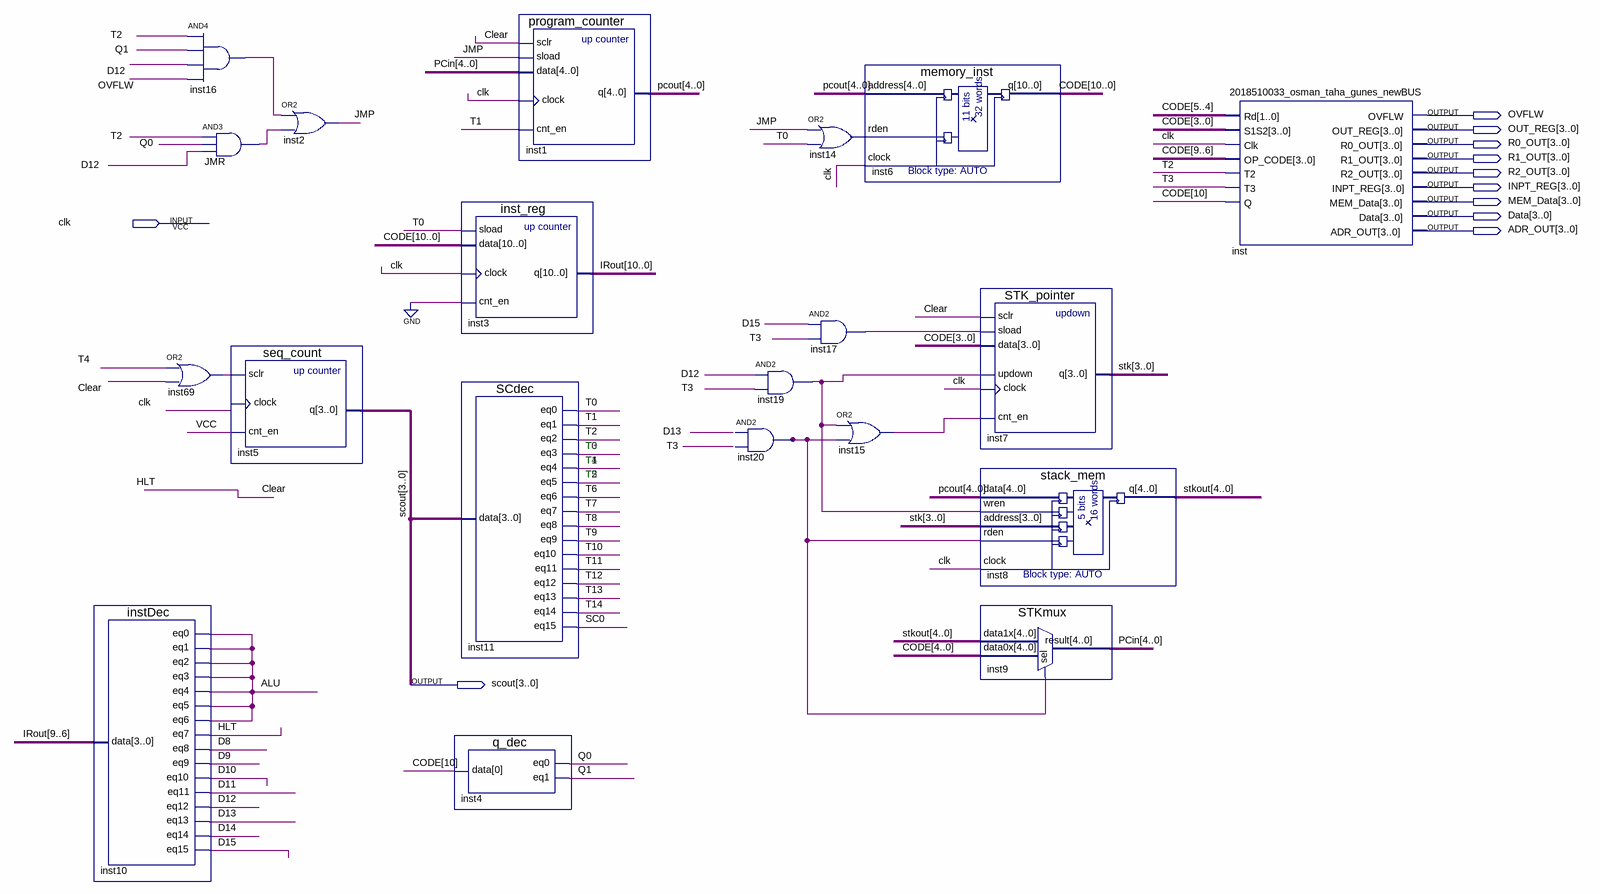
[diagram p0: schematic sheet]
// Quartus schematic 2018510033_osman_taha_gunes_DEUNIAC.bdf as structural Verilog: 20 symbols, 11 pins
module \2018510033_osman_taha_gunes_DEUNIAC  (
  input  clk,
  output OVFLW,
  output [3:0] OUT_REG,
  output [3:0] R0_OUT,
  output [3:0] R1_OUT,
  output [3:0] R2_OUT,
  output [3:0] INPT_REG,
  output [3:0] MEM_Data,
  output [3:0] Data,
  output [3:0] ADR_OUT,
  output [3:0] scout
);

  wire ALU, Clear, D8, D9, D10, D11, D12, D13, D14, D15, inst14_out, inst15_out, inst16_out, inst17_out,
       inst19_out, inst20_out, inst69_out, JMP, JMR_out, Q0, Q1, SC0, T0, T1, T2, T3, T4, T6, T7, T8, T9,
       T10, T11, T12, T13, T14, VCC;
  wire [3:0] stk;
  wire [4:0] PCin, pcout, stkout;
  wire [10:0] CODE, IRout;

  instDec inst10 (
    .data(IRout[9:6]), .eq0(ALU), .eq1(ALU), .eq2(ALU), .eq3(ALU), .eq4(ALU), .eq5(ALU), .eq6(ALU),
    .eq7(Clear), .eq8(D8), .eq9(D9), .eq10(D10), .eq11(D11), .eq12(D12), .eq13(D13), .eq14(D14), .eq15(D15));
  and inst16 (inst16_out, T2, Q1, D12, OVFLW);
  or inst69 (inst69_out, T4, Clear);
  and JMR (JMR_out, T2, Q0, D12);
  seq_count inst5 (.sclr(inst69_out), .clock(clk), .cnt_en(VCC), .q(scout));
  or inst2 (JMP, inst16_out, JMR_out);
  inst_reg inst3 (.sload(T0), .data(CODE), .clock(clk), .cnt_en(1'b0), .q(IRout));
  SCdec inst11 (
    .data(scout), .eq0(T0), .eq1(T1), .eq2(T2), .eq3(T0), .eq4(T1), .eq5(T2), .eq6(T6), .eq7(T7), .eq8(T8),
    .eq9(T9), .eq10(T10), .eq11(T11), .eq12(T12), .eq13(T13), .eq14(T14), .eq15(SC0));
  q_dec inst4 (.data(CODE[10]), .eq0(Q0), .eq1(Q1));
  program_counter inst1 (.sclr(Clear), .sload(JMP), .data(PCin), .clock(clk), .cnt_en(T1), .q(pcout));
  and inst19 (inst19_out, D12, T3);
  // AND2 inst20 has open pins: IN1=open, IN2=open, OUT=inst20_out
  or inst14 (inst14_out, JMP, T0);
  and inst17 (inst17_out, D15, T3);
  memory_inst inst6 (.address(pcout), .rden(inst14_out), .clock(clk), .q(CODE));
  or inst15 (inst15_out, inst19_out, inst20_out);
  STK_pointer inst7 (
    .sclr(Clear), .sload(inst17_out), .data(CODE[3:0]), .updown(inst19_out), .clock(clk),
    .cnt_en(inst15_out), .q(stk));
  stack_mem inst8 (.data(pcout), .wren(inst19_out), .address(stk), .rden(inst20_out), .clock(clk), .q(stkout));
  STKmux inst9 (.data1x(stkout), .data0x(CODE[4:0]), .sel(inst20_out), .result(PCin));
  \2018510033_osman_taha_gunes_newBUS  inst (
    .Rd(CODE[5:4]), .S1S2(CODE[3:0]), .Clk(clk), .OP_CODE(CODE[9:6]), .T2(T2), .T3(T3), .Q(CODE[10]),
    .OVFLW(OVFLW), .OUT_REG(OUT_REG), .R0_OUT(R0_OUT), .R1_OUT(R1_OUT), .R2_OUT(R2_OUT), .INPT_REG(INPT_REG),
    .MEM_Data(MEM_Data), .Data(Data), .ADR_OUT(ADR_OUT));

  // Other names for the same wires on the sheet: HLT = Clear

  // Notes on the sheet:
  //   T3
  //   T4
  //   T5
endmodule
